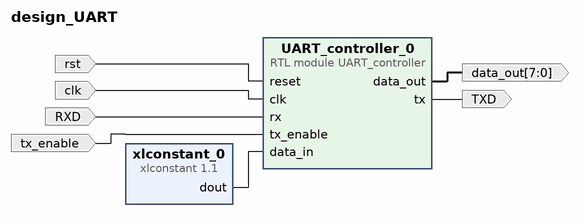
[diagram p0: block diagram of the top level]
# Vivado block design design_UART, xc7z020clg400-1, Vivado 2020.1
create_bd_design design_UART

create_bd_port -dir I -type rst rst
create_bd_port -dir I -type clk clk
create_bd_port -dir O -from 7 -to 0 data_out
create_bd_port -dir I RXD
create_bd_port -dir O TXD
create_bd_port -dir I tx_enable

create_bd_cell -type ip -vlnv xilinx.com:ip:xlconstant:1.1 xlconstant_0
set_property -dict {CONFIG.CONST_VAL 123 CONFIG.CONST_WIDTH 8} [get_bd_cells xlconstant_0]
create_bd_cell -type module -reference UART_controller UART_controller_0

# ---- connections ----

connect_bd_net -net reset_0_1 [get_bd_ports rst] [get_bd_pins UART_controller_0/reset]
connect_bd_net -net clk_0_1 [get_bd_ports clk] [get_bd_pins UART_controller_0/clk]
connect_bd_net [get_bd_pins UART_controller_0/data_out] [get_bd_ports data_out]
connect_bd_net -net rx_0_1 [get_bd_ports RXD] [get_bd_pins UART_controller_0/rx]
connect_bd_net [get_bd_pins UART_controller_0/tx] [get_bd_ports TXD]
connect_bd_net -net tx_enable_0_1 [get_bd_ports tx_enable] [get_bd_pins UART_controller_0/tx_enable]
connect_bd_net [get_bd_pins xlconstant_0/dout] [get_bd_pins UART_controller_0/data_in]

validate_bd_design
save_bd_design
